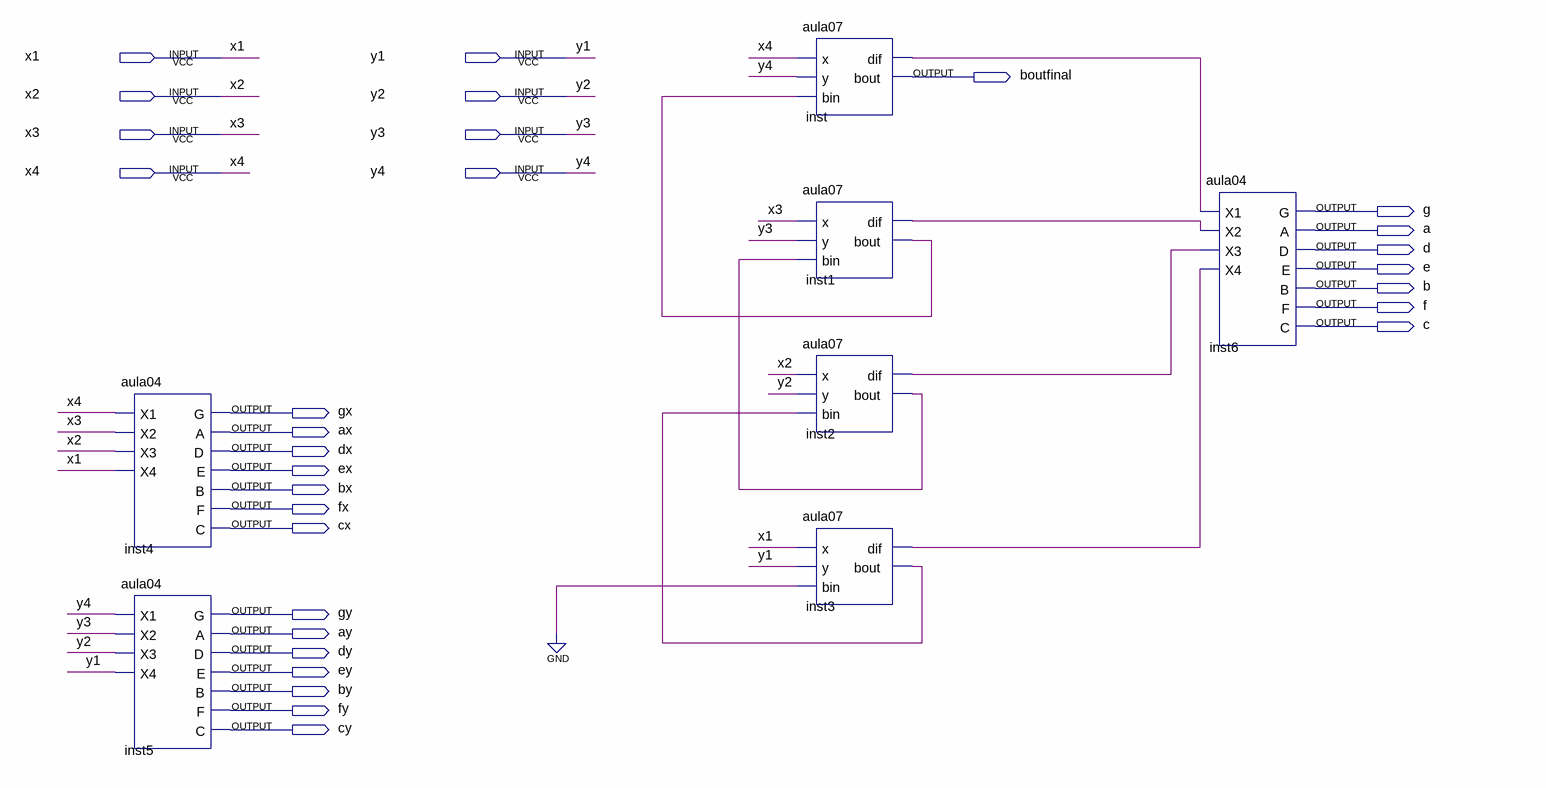
[diagram p0: schematic sheet]
// Quartus schematic aula08.bdf as structural Verilog: 7 symbols, 30 pins
module aula08 (
  input  x1,
  input  y1,
  input  x2,
  input  y2,
  input  x3,
  input  y3,
  input  x4,
  input  y4,
  output boutfinal,
  output g,
  output a,
  output d,
  output e,
  output b,
  output f,
  output c,
  output gx,
  output ax,
  output dx,
  output ex,
  output bx,
  output fx,
  output cx,
  output gy,
  output ay,
  output dy,
  output ey,
  output by,
  output fy,
  output cy
);

  wire inst1_bout, inst1_dif, inst2_bout, inst2_dif, inst3_bout, inst3_dif, inst_dif;

  aula04 inst4 (.X1(x4), .X2(x3), .X3(x2), .X4(x1), .G(gx), .A(ax), .D(dx), .E(ex), .B(bx), .F(fx), .C(cx));
  aula04 inst5 (.X1(y4), .X2(y3), .X3(y2), .X4(y1), .G(gy), .A(ay), .D(dy), .E(ey), .B(by), .F(fy), .C(cy));
  aula07 inst (.x(x4), .y(y4), .bin(inst1_bout), .dif(inst_dif), .bout(boutfinal));
  aula07 inst1 (.x(x3), .y(y3), .bin(inst2_bout), .dif(inst1_dif), .bout(inst1_bout));
  aula07 inst2 (.x(x2), .y(y2), .bin(inst3_bout), .dif(inst2_dif), .bout(inst2_bout));
  aula07 inst3 (.x(x1), .y(y1), .bin(1'b0), .dif(inst3_dif), .bout(inst3_bout));
  aula04 inst6 (
    .X1(inst_dif), .X2(inst1_dif), .X3(inst2_dif), .X4(inst3_dif), .G(g), .A(a), .D(d), .E(e), .B(b), .F(f),
    .C(c));
endmodule
